# Altium schematic sheet Main.SchDoc
size A4
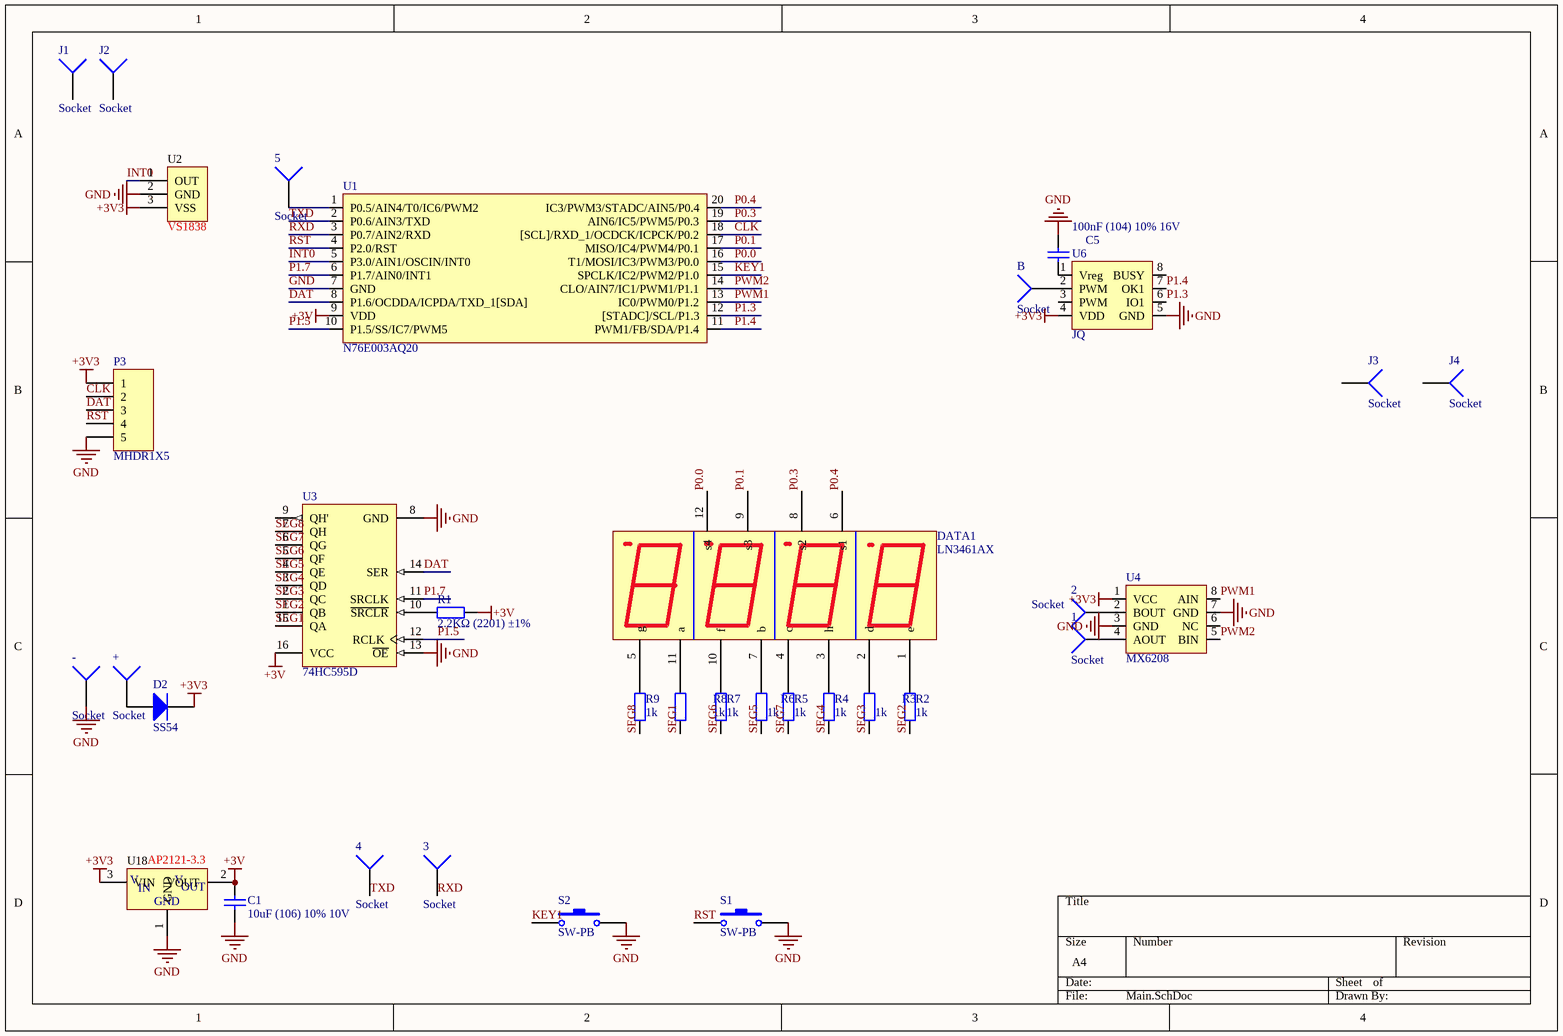
[diagram p0: Main.SchDoc]

## Parts
1  Socket  [MODULE-PAD$2F$3]
2  Socket  [MODULE-PAD$2F$3]
3  Socket  [MODULE-PAD$2F$3]
4  Socket  [MODULE-PAD$2F$3]
5  Socket  [MODULE-PAD$2F$3]
+  Socket  [MODULE-PAD$2F$3]
-  Socket  [MODULE-PAD$2F$3]
B  Socket  [MODULE-PAD$2F$3]
C1  10uF (106) 10% 10V  [0603_C]
C5  100nF (104) 10% 16V  [0402_C]
D2  SS54  [SMA(DO-214AC)_S1]
DATA1  LN3461AX  [DIP12:DISP2]
J1  Socket  [FPAD_1]
J2  Socket  [FPAD_1]
J3  Socket  [FPAD_1]
J4  Socket  [FPAD_1]
P3  MHDR1X5  [MHDR1X5]
R1  2.2KΩ (2201) ±1%  [0402_R]
R2  1k  [0402_R]
R3  1k  [0402_R]
R4  1k  [0402_R]
R5  1k  [0402_R]
R6  1k  [0402_R]
R7  1k  [0402_R]
R8  1k  [0402_R]
R9  1k  [0402_R]
S1  SW-PB  [SB1$2F$2]
S2  SW-PB  [SB1$2F$2]
U1  N76E003AQ20  [TSSOP20]
U2  VS1838  [LF0038Q]
U3  74HC595D  [SOIC-16_150mil]
U4  MX6208  [SOIC-8_150mil]
U6  JQ  [SOIC-8_150mil]
U18  AP2121-3.3  [SOT-23]

## Nets
+3V: C1.2 R1.2 U1.9(VDD) U3.16(VCC) U18.2(VOUT)
+3V3: D2.2(K) P3.1 U2.3(VSS) U4.1(VCC) U6.4(VDD) U18.3(VIN)
GND: -.1 C1.1 C5.2 P3.5 S1.2 S2.2 U1.7(GND) U2.2(GND) U3.8(GND) U3.13(~{OE}) U4.3(GND) U4.7(GND) U6.5(GND) U18.1(GND)
CLK: P3.2 U1.18([SCL]/RXD_1/OCDCK/ICPCK/P0.2)
DAT: P3.3 U1.8(P1.6/OCDDA/ICPDA/TXD_1[SDA]) U3.14(SER)
INT0: U1.5(P3.0/AIN1/OSCIN/INT0) U2.1(OUT)
KEY1: S2.1 U1.15(SPCLK/IC2/PWM2/P1.0)
P0.0: DATA1.12(s4) U1.16(T1/MOSI/IC3/PWM3/P0.0)
P0.1: DATA1.9(s3) U1.17(MISO/IC4/PWM4/P0.1)
P0.3: DATA1.8(s2) U1.19(AIN6/IC5/PWM5/P0.3)
P0.4: DATA1.6(s1) U1.20(IC3/PWM3/STADC/AIN5/P0.4)
P1.3: U1.12([STADC]/SCL/P1.3) U6.6(IO1)
P1.4: U1.11(PWM1/FB/SDA/P1.4) U6.7(OK1)
P1.5: U1.10(P1.5/SS/IC7/PWM5) U3.12(RCLK)
P1.7: U1.6(P1.7/AIN0/INT1) U3.11(SRCLK)
PWM1: U1.13(IC0/PWM0/P1.2) U4.8(AIN)
PWM2: U1.14(CLO/AIN7/IC1/PWM1/P1.1) U4.5(BIN)
RST: P3.4 S1.1 U1.4(P2.0/RST)
RXD: 3.1 U1.3(P0.7/AIN2/RXD)
SEG1: R8.2 U3.15(QA)
SEG2: R2.2 U3.1(QB)
SEG3: R3.2 U3.2(QC)
SEG4: R4.2 U3.3(QD)
SEG5: R6.2 U3.4(QE)
SEG6: R7.2 U3.5(QF)
SEG7: R5.2 U3.6(QG)
SEG8: R9.2 U3.7(QH)
TXD: 4.1 U1.2(P0.6/AIN3/TXD)
Net1_1: 1.1 U4.4(AOUT)
Net2_1: 2.1 U4.2(BOUT)
Net5_1: 5.1 U1.1(P0.5/AIN4/T0/IC6/PWM2)
Net+_1: +.1 D2.1(A)
NetB_1: B.1 U6.2(PWM)
NetC5_1: C5.1 U6.1(Vreg)
NetDATA1_1: DATA1.1(e) R2.1
NetDATA1_2: DATA1.2(d) R3.1
NetDATA1_3: DATA1.3(h) R4.1
NetDATA1_4: DATA1.4(c) R5.1
NetDATA1_5: DATA1.5(g) R9.1
NetDATA1_7: DATA1.7(b) R6.1
NetDATA1_10: DATA1.10(f) R7.1
NetDATA1_11: DATA1.11(a) R8.1
NetR1_1: R1.1 U3.10(~{SRCLR})

Not connected (* = marked no-connect by the designer): J1 1; J2 1; J3 1; J4 1; U3 9(QH'); U4 6(NC); U6 3(PWM) 8(BUSY)

## Notes on the sheet
- (in symbol AP2121-3) V; IN; OUT

## Library data of the parts
C1 = 0603 10uF (106) 10% 10V: 贴片电容; ComponentLink1Description: 供应商链接; ComponentLink1URL: http://www.szlcsc.com/product/details_20411.html; Package: 0603; Supplier: LC; SuppliersPartNumber: C19702
C5 = 0402 100nF (104) 10% 16V: 贴片电容; ComponentLink1Description: 供应商链接; ComponentLink1URL: http://www.szlcsc.com/product/details_1877.html; Package: 0402; Supplier: LC; SuppliersPartNumber: C1525
D2 = SMA(DO-214AC) SS54: 二极管; ComponentLink1Description: 供应商链接; ComponentLink1URL: http://www.szlcsc.com/product/details_23178.html; Package: SMA(DO-214AC); Supplier: LC; SuppliersPartNumber: C22452
DATA1 = DATA04: data?
P3 = MHDR1X5: Header, 5-Pin; LatestRevisionDate: 17-Jul-2002; LatestRevisionNote: Re-released for DXP Platform.; Publisher: Altium Limited
R1-R9 = 0402 2.2KΩ (2201) 1%: 贴片电阻; ComponentLink1Description: 供应商链接; ComponentLink1URL: http://www.szlcsc.com/product/details_26622.html; Package: 0402; Supplier: LC; SuppliersPartNumber: C25879
S1 S2 = SW-PB: Switch; Published: 24-Mar-1999; LatestRevisionDate: 17-Jul-2002; LatestRevisionNote: Re-released for DXP Platform.; PackageReference: SPST-2; Publisher: Altium Limited; PackageDescription: Switch; 2 Leads
U2 = RF: 1838 接收头 VS1838 VS1838B
U3 = 74HC595D: 74系列逻辑芯片; ComponentLink1Description: 供应商链接; ComponentLink1URL: http://www.szlcsc.com/product/details_6413.html; Package: SOIC-16_150mil; Supplier: LC; SuppliersPartNumber: C5947
U18 = AP2121-3: 3V LDO
1-5 + - B J1-J4 = Socket: LatestRevisionDate: 17-Jul-2002; LatestRevisionNote: Re-released for DXP Platform.; Publisher: Altium Limited